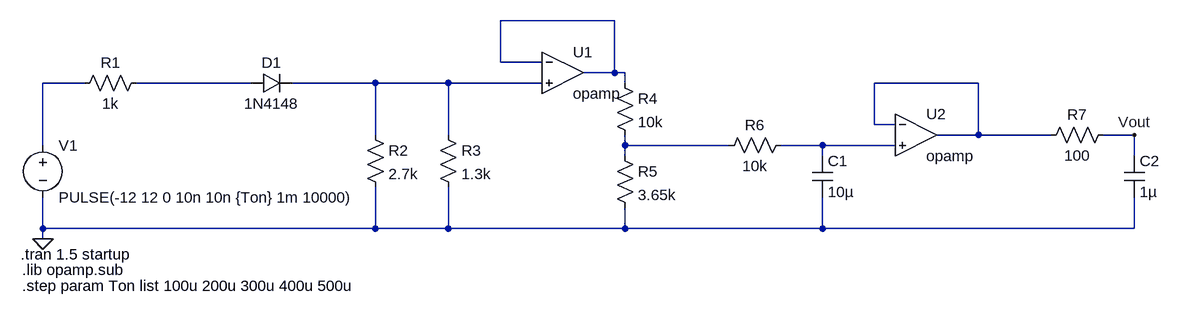
[diagram p0: schematic Control Pilot.asc]
Control Pilot.asc, the LTspice schematic file:
Version 4
SHEET 1 1784 680
WIRE 928 -48 752 -48
WIRE 752 16 752 -48
WIRE 816 16 752 16
WIRE 928 32 928 -48
WIRE 928 32 880 32
WIRE 944 32 928 32
WIRE 112 48 48 48
WIRE 368 48 192 48
WIRE 560 48 432 48
WIRE 672 48 560 48
WIRE 816 48 672 48
WIRE 944 48 944 32
WIRE 1488 48 1328 48
WIRE 1328 112 1328 48
WIRE 1360 112 1328 112
WIRE 560 128 560 48
WIRE 672 128 672 48
WIRE 1488 128 1488 48
WIRE 1488 128 1424 128
WIRE 1600 128 1488 128
WIRE 1728 128 1680 128
WIRE 48 144 48 48
WIRE 944 144 944 128
WIRE 1104 144 944 144
WIRE 1248 144 1184 144
WIRE 1360 144 1248 144
WIRE 944 160 944 144
WIRE 1248 160 1248 144
WIRE 1728 160 1728 128
WIRE 48 272 48 224
WIRE 560 272 560 208
WIRE 560 272 48 272
WIRE 672 272 672 208
WIRE 672 272 560 272
WIRE 944 272 944 240
WIRE 944 272 672 272
WIRE 1248 272 1248 224
WIRE 1248 272 944 272
WIRE 1728 272 1728 224
WIRE 1728 272 1248 272
WIRE 48 288 48 272
FLAG 48 288 0
FLAG 1728 128 Vout
SYMBOL voltage 48 128 R0
WINDOW 123 0 0 Left 0
WINDOW 39 0 0 Left 0
SYMATTR InstName V1
SYMATTR Value PULSE(-12 12 0 10n 10n {Ton} 1m 10000)
SYMBOL res 208 32 R90
WINDOW 0 0 56 VBottom 2
WINDOW 3 32 56 VTop 2
SYMATTR InstName R1
SYMATTR Value 1k
SYMBOL diode 368 64 R270
WINDOW 0 32 32 VTop 2
WINDOW 3 0 32 VBottom 2
SYMATTR InstName D1
SYMATTR Value 1N4148
SYMBOL res 544 112 R0
SYMATTR InstName R2
SYMATTR Value 2.7k
SYMBOL res 656 112 R0
SYMATTR InstName R3
SYMATTR Value 1.3k
SYMBOL Opamps\\opamp 848 -32 R0
SYMATTR InstName U1
SYMBOL Opamps\\opamp 1392 64 R0
SYMATTR InstName U2
SYMBOL res 928 32 R0
SYMATTR InstName R4
SYMATTR Value 10k
SYMBOL res 928 144 R0
SYMATTR InstName R5
SYMATTR Value 3.65k
SYMBOL res 1200 128 R90
WINDOW 0 0 56 VBottom 2
WINDOW 3 32 56 VTop 2
SYMATTR InstName R6
SYMATTR Value 10k
SYMBOL cap 1232 160 R0
SYMATTR InstName C1
SYMATTR Value 10µ
SYMATTR SpiceLine V=10 Irms=0 Rser=0 Lser=0 mfg="Murata" pn="GRM188R61A106KE69" type="X5R"
SYMBOL res 1696 112 R90
WINDOW 0 0 56 VBottom 2
WINDOW 3 32 56 VTop 2
SYMATTR InstName R7
SYMATTR Value 100
SYMBOL cap 1712 160 R0
SYMATTR InstName C2
SYMATTR Value 1µ
TEXT 14 312 Left 2 !.tran 1.5 startup
TEXT 16 336 Left 2 !.lib opamp.sub
TEXT 16 360 Left 2 !.step param Ton list 100u 200u 300u 400u 500u

The netlist it stands for:
* Control Pilot.asc
V1 N002 0 PULSE(-12 12 0 10n 10n {Ton} 1m 10000)
R1 N003 N002 1k
D1 N003 N004 1N4148
R2 N004 0 2.7k
R3 N004 0 1.3k
XU1 N001 N004 N001 opamp Aol=100K GBW=10Meg  ; pins invin noninvin out
XU2 N005 N007 N005 opamp Aol=100K GBW=10Meg  ; pins invin noninvin out
R4 N001 N006 10k
R5 N006 0 3.65k
R6 N007 N006 10k
C1 N007 0 10µ V=10 Irms=0 Rser=0 Lser=0 mfg="Murata" pn="GRM188R61A106KE69" type="X5R"
R7 Vout N005 100
C2 Vout 0 1µ
.model D D
.lib standard.dio
.tran 1.5 startup
.lib opamp.sub
.step param Ton list 100u 200u 300u 400u 500u
.backanno
.end